# Altium schematic sheet Sheet3.SchDoc
size A3; DocumentNumber: 3; SheetNumber: 3; SheetTotal: 6
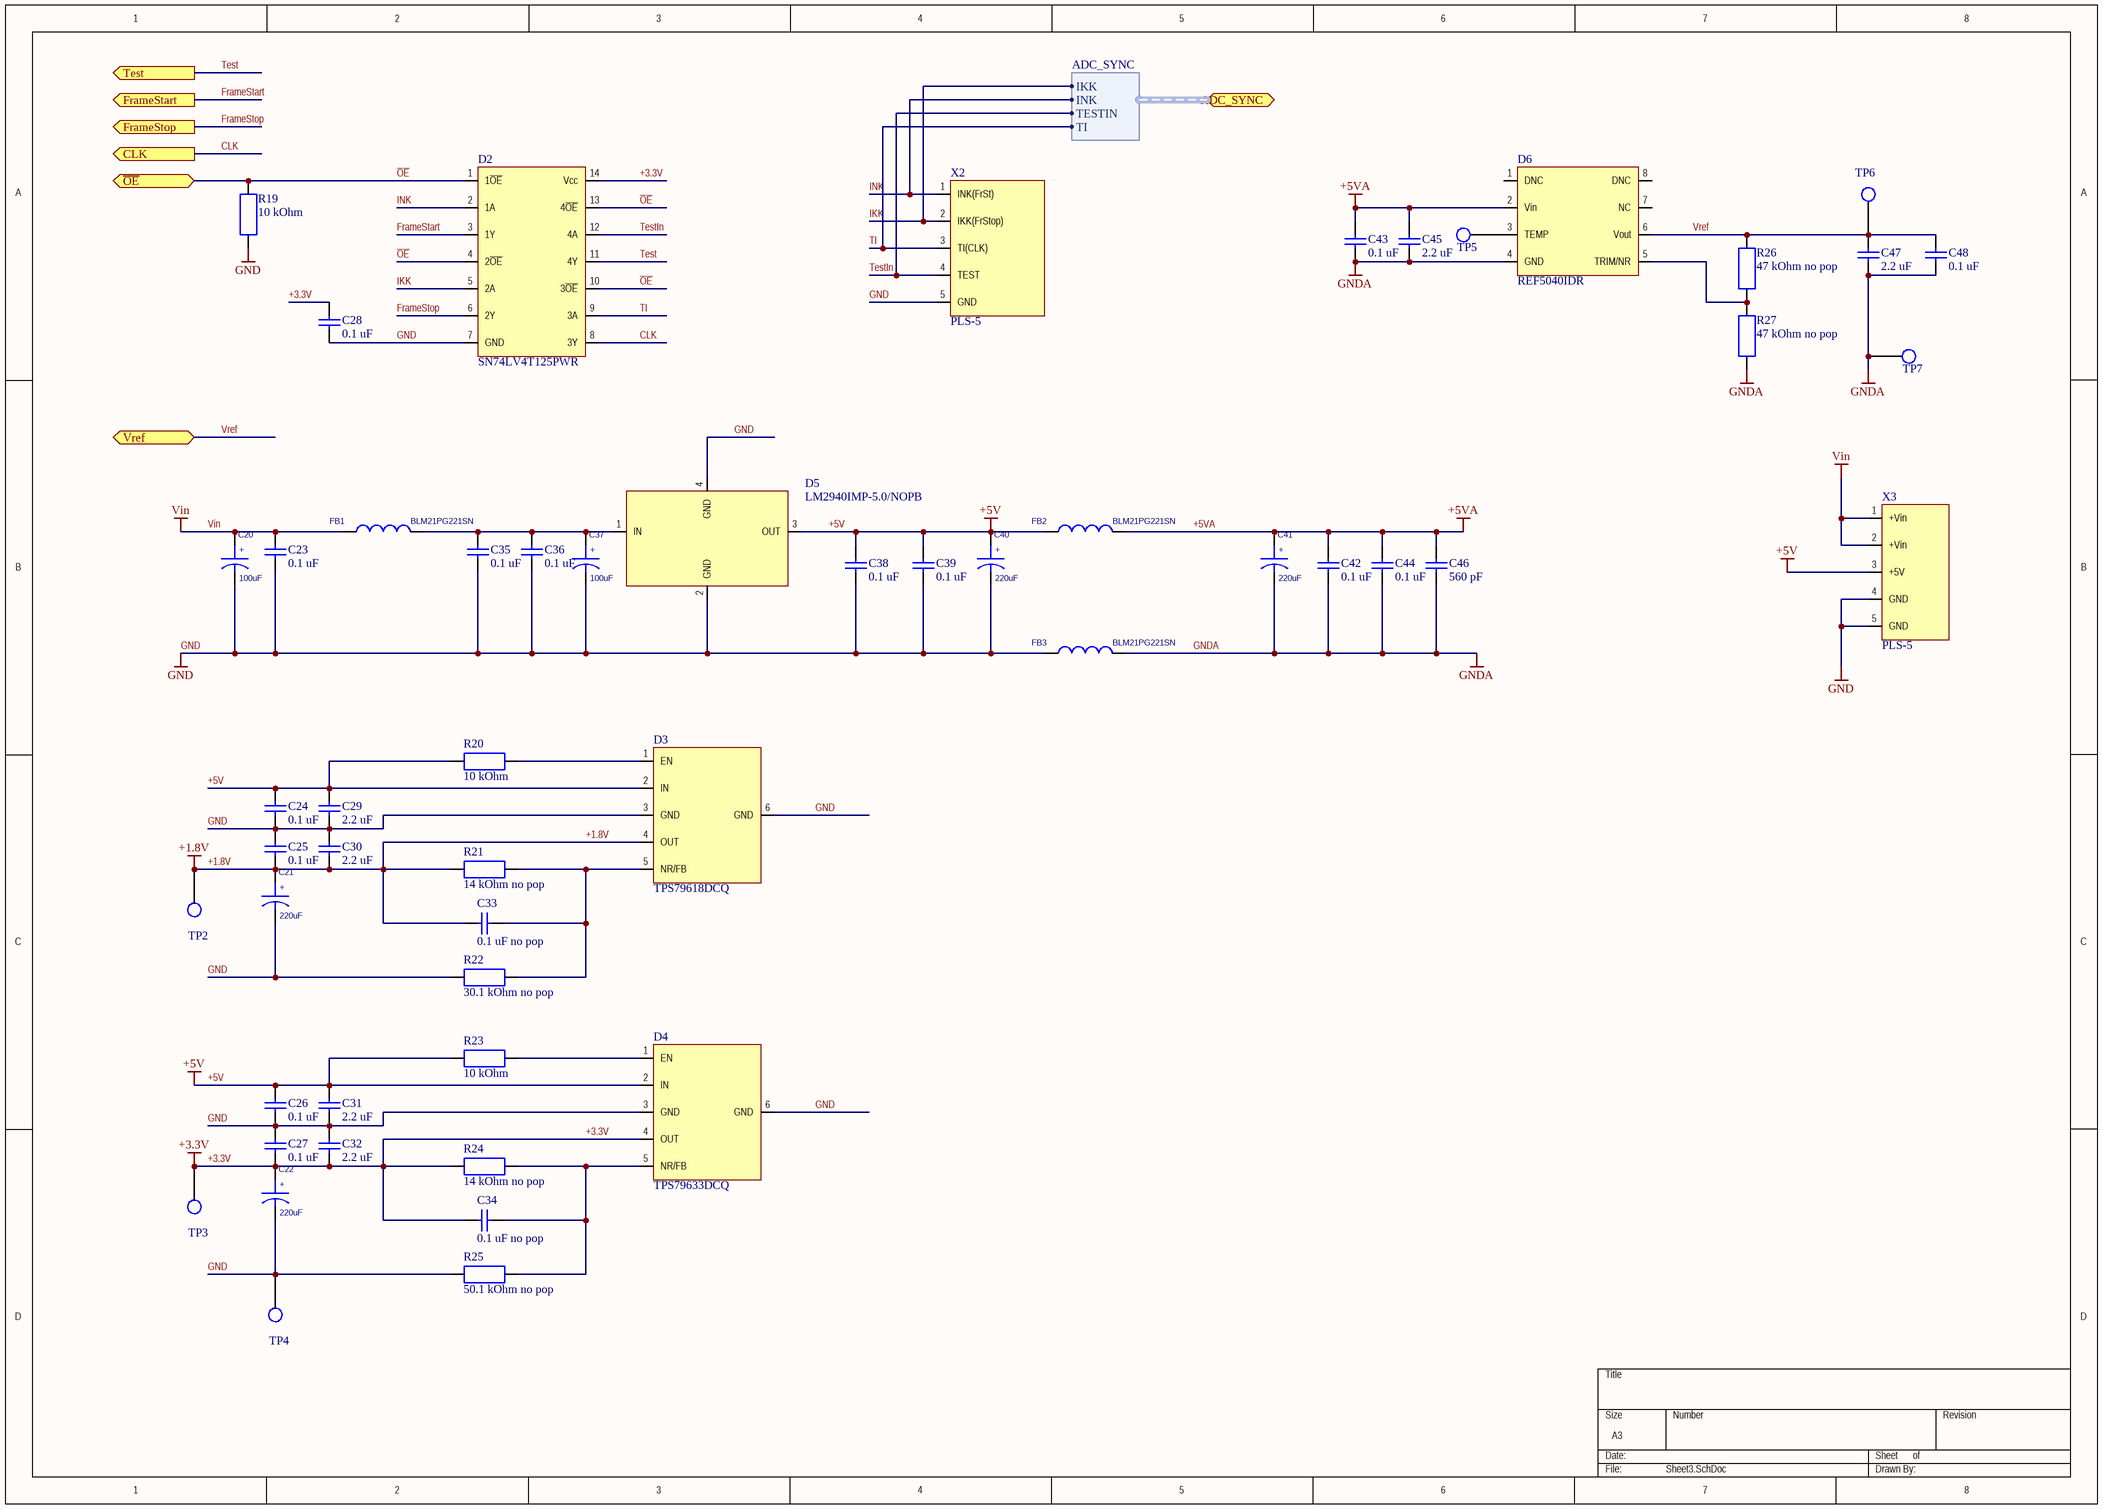
[diagram p0: Sheet3.SchDoc]

## Parts
C20  100uF  [TC7343-2917]
C21  220uF  [TC7343-2917]
C22  220uF  [TC7343-2917]
C23  0.1 uF  [CAPC1608N]
C24  0.1 uF  [CAPC1608N]
C25  0.1 uF  [CAPC1608N]
C26  0.1 uF  [CAPC1608N]
C27  0.1 uF  [CAPC1608N]
C28  0.1 uF  [CAPC1608N]
C29  2.2 uF  [CAPC1608N]
C30  2.2 uF  [CAPC1608N]
C31  2.2 uF  [CAPC1608N]
C32  2.2 uF  [CAPC1608N]
C33  0.1 uF no pop  [CAPC1608N]
C34  0.1 uF no pop  [CAPC1608N]
C35  0.1 uF  [CAPC1608N]
C36  0.1 uF  [CAPC1608N]
C37  100uF  [TC7343-2917]
C38  0.1 uF  [CAPC1608N]
C39  0.1 uF  [CAPC1608N]
C40  220uF  [TC7343-2917]
C41  220uF  [TC7343-2917]
C42  0.1 uF  [CAPC1608N]
C43  0.1 uF  [CAPC1608N]
C44  0.1 uF  [CAPC1608N]
C45  2.2 uF  [CAPC1608N]
C46  560 pF  [CAPC1608N]
C47  2.2 uF  [CAPC1608N]
C48  0.1 uF  [CAPC1608N]
D2  SN74LV4T125PWR  [TSOP65P640X120-14N]
D3  TPS79618DCQ  [SOT127P706X180-6N]
D4  TPS79633DCQ  [SOT127P706X180-6N]
D5  LM2940IMP-5.0/NOPB  [SOT230P700X180-4N]
D6  REF5040IDR  [SO8]
FB1  BLM21PG221SN  [INDC2009M]
FB2  BLM21PG221SN  [INDC2009M]
FB3  BLM21PG221SN  [INDC2009M]
R19  10 kOhm  [RESC1608N]
R20  10 kOhm  [RESC1608N]
R21  14 kOhm no pop  [RESC1608N]
R22  30.1 kOhm no pop  [RESC1608N]
R23  10 kOhm  [RESC1608N]
R24  14 kOhm no pop  [RESC1608N]
R25  50.1 kOhm no pop  [RESC1608N]
R26  47 kOhm no pop  [RESC1608N]
R27  47 kOhm no pop  [RESC1608N]
TP2  PLS-1  [TPSW]  (value not drawn)
TP3  PLS-1  [TPSW]  (value not drawn)
TP4  PLS-1  [TPSW]  (value not drawn)
TP5  PLS-1  [TPSW]  (value not drawn)
TP6  PLS-1  [TPSW]  (value not drawn)
TP7  PLS-1  [TPSW]  (value not drawn)
X2  PLS-5  [PLS-5]
X3  PLS-5  [PLS-5]

## Ports
ADC_SYNC (harness ADC_SYNC), CLK (out), FrameStart (out), FrameStop (out), Test (out), Vref, ~{OE}

## Harnesses
ADC_SYNC: IKK, INK, TESTIN, TI

## Nets
+1.8V: C21.1(Positive) C25.1 C30.1 C33.2 D3.4(OUT) R21.2 TP2.1
+3.3V: C22.1(Positive) C27.1 C28.2 C32.1 C34.2 D2.14(Vcc) D4.4(OUT) R24.2 TP3.1
+5V: C24.2 C26.2 C29.2 C31.2 C38.2 C39.2 C40.1(Positive) D3.2(IN) D4.2(IN) D5.3(OUT) FB2.1 R20.2 R23.2 X3.3(+5V)
+5VA: C41.1(Positive) C42.2 C43.2 C44.2 C45.2 C46.2 D6.2(Vin) FB2.2
GND: C20.2(Negative) C21.2(Negative) C22.2(Negative) C23.1 C24.1 C25.2 C26.1 C27.2 C28.1 C29.1 C30.2 C31.1 C32.2 C35.1 C36.1 C37.2(Negative) C38.1 C39.1 C40.2(Negative) D2.7(GND) D3.3(GND) D3.6(GND) D4.3(GND) D4.6(GND) D5.2(GND) D5.4(GND) FB3.1 R19.1 R22.2 R25.2 TP4.1 X2.5(GND) X3.4(GND) X3.5(GND)
GNDA: C41.2(Negative) C42.1 C43.1 C44.1 C45.1 C46.1 C47.1 C48.1 D6.4(GND) FB3.2 R27.2 TP7.1
Vin: C20.1(Positive) C23.2 FB1.1 X3.1(+Vin) X3.2(+Vin)
CLK: D2.8(3Y) ; port CLK
FrameStart: D2.3(1Y) ; port FrameStart
FrameStop: D2.6(2Y) ; port FrameStop
IKK: D2.5(2A) X2.2(IKK(FrStop)) ; port ADC_SYNC.IKK
INK: D2.2(1A) X2.1(INK(FrSt)) ; port ADC_SYNC.INK
~{OE}: D2.1(1~{OE}) D2.4(2~{OE}) D2.10(3~{OE}) D2.13(4~{OE}) R19.2 ; port ~{OE}
Test: D2.11(4Y) ; port Test
TestIn: D2.12(4A) X2.4(TEST) ; port ADC_SYNC.TESTIN
TI: D2.9(3A) X2.3(TI(CLK)) ; port ADC_SYNC.TI
Vref: C47.2 C48.2 D6.6(Vout) R26.2 TP6.1 ; port Vref
NetC33_1: C33.1 D3.5(NR/FB) R21.1 R22.1
NetC34_1: C34.1 D4.5(NR/FB) R24.1 R25.1
NetC35_2: C35.2 C36.2 C37.1(Positive) D5.1(IN) FB1.2
NetD3_1: D3.1(EN) R20.1
NetD4_1: D4.1(EN) R23.1
NetD6_3: D6.3(TEMP) TP5.1
NetD6_5: D6.5(TRIM/NR) R26.1 R27.1

Not connected (* = marked no-connect by the designer): D6 1(DNC) 7(NC) 8(DNC)

## Notes on the sheet
- (in symbol CAP TANTAL CASE E) +

## Library data of the parts
C20-C22 C37 C40 C41 = CAP TANTAL CASE E: Vendor Part#: 495-2256-1-ND; Mfg Part#: B45196H3107M409; Vendor: DigiKey; Mfg: Kemet; Specifications: CAP TANTALUM 100UF 16V 20% SMD; Oper. Temp. Range: -55C to 125C; RoHS: Yes; Package: 7343-31
C23-C36 C38 C39 C42-C48 = CC0603: ±10%, X7R, 0603; MaxVoltage: 10Vdc; Value: 1µF; Published: 2014; LatestRevisionDate: 2014; LatestRevisionNote: Re-released for DXP Platform.; PackageReference: RAD-0.3; Publisher: DS; PackageDescription: ChipCapasitor; HelpURL: http://product.tdk.com/capacitor/mlcc/en/documents/mlcc_commercial_general_en.pdf; Supplier 1: Digi-Key; Supplier Part Number 1: 445-4998-1-ND
D2 = SN74LV4T125PWR: SN74LV4T125PWR voltage level converter; Supplier 1: Mouser; Supplier Part Number 1: 595-SN74LV4T125PWR
D5 = LM2940IMP-5.0/NOPB: 5V LDO
FB1-FB3 = BLM21: Mfg Part#: BLM18PG121SN1D; Vendor Part#: 490-1037-1-ND; Mfg: Murata; Vendor: DigiKey; Specifications: FERRITE CHIP 120 OHM 2000MA 0603; Oper. Temp. Range: -55C to 125C; Package: 0603; RoHS: Yes; Supplier 1: Digi-Key; Supplier Part Number 1: 490-1054-6-ND
R19-R27 = RES0603: ±5%, 0603; MaxVoltage: 10Vdc; Value: 1µF; Published: 2014; LatestRevisionDate: 2014; LatestRevisionNote: Re-released for DXP Platform.; PackageReference: RAD-0.3; Publisher: DS; PackageDescription: ChipCapasitor; HelpURL: http://product.tdk.com/capacitor/mlcc/en/documents/mlcc_commercial_general_en.pdf
X2 = SYNCIN
X3 = PWRIN
D3 = TPS79618DCQ: Supplier 1: Mouser; Supplier Part Number 1: 595-TPS79601DCQR
D4 = TPS79633DCQ: Supplier 1: Mouser; Supplier Part Number 1: 595-TPS79601DCQR